# Altium schematic sheet Driver_Push Pull.SchDoc
size 76 x 50 mm
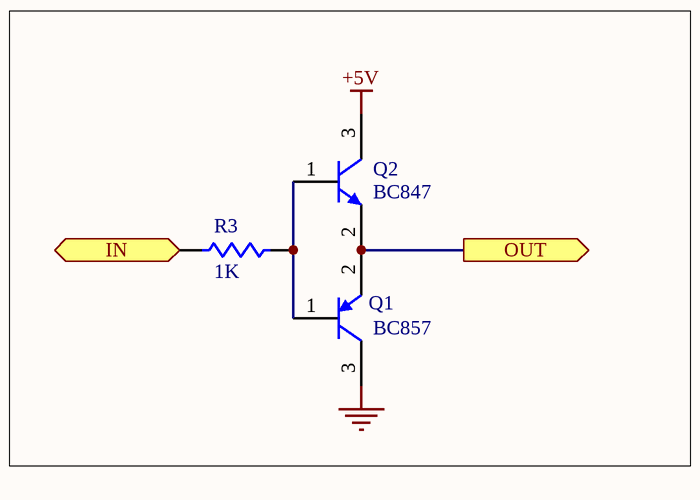
[diagram p0: Driver_Push Pull.SchDoc]

## Parts
Q1  BC857  [SOT23-3N]
Q2  BC847  [SOT23-3N]
R3  1K  [0805]

## Ports
IN (in), OUT (out)

## Nets
+5V: Q2.3(C)
GND: Q1.3(C)
IN: R3.2 ; port IN
OUT: Q1.2(E) Q2.2(E) ; port OUT
NetQ1_1: Q1.1(B) Q2.1(B) R3.1

## Library data of the parts
Q1 = BC857: Silicon Bipolar Transistor
Q2 = BC847: Silicon Bipolar Transistor
R3 = Res1: Resistor; Manufacturer: Generic Components; Class I: Passive; Published: 8-Jun-2000; Revision: July-2002: Re-released for DXP Platform.; Publisher: Altium Limited; Class II: Resistor